# Altium schematic sheet sbc-base.SchDoc
size A3; DocumentNumber: 44; SheetNumber: 44; SheetTotal: 45; SheetDescription: System basic chip for MCU
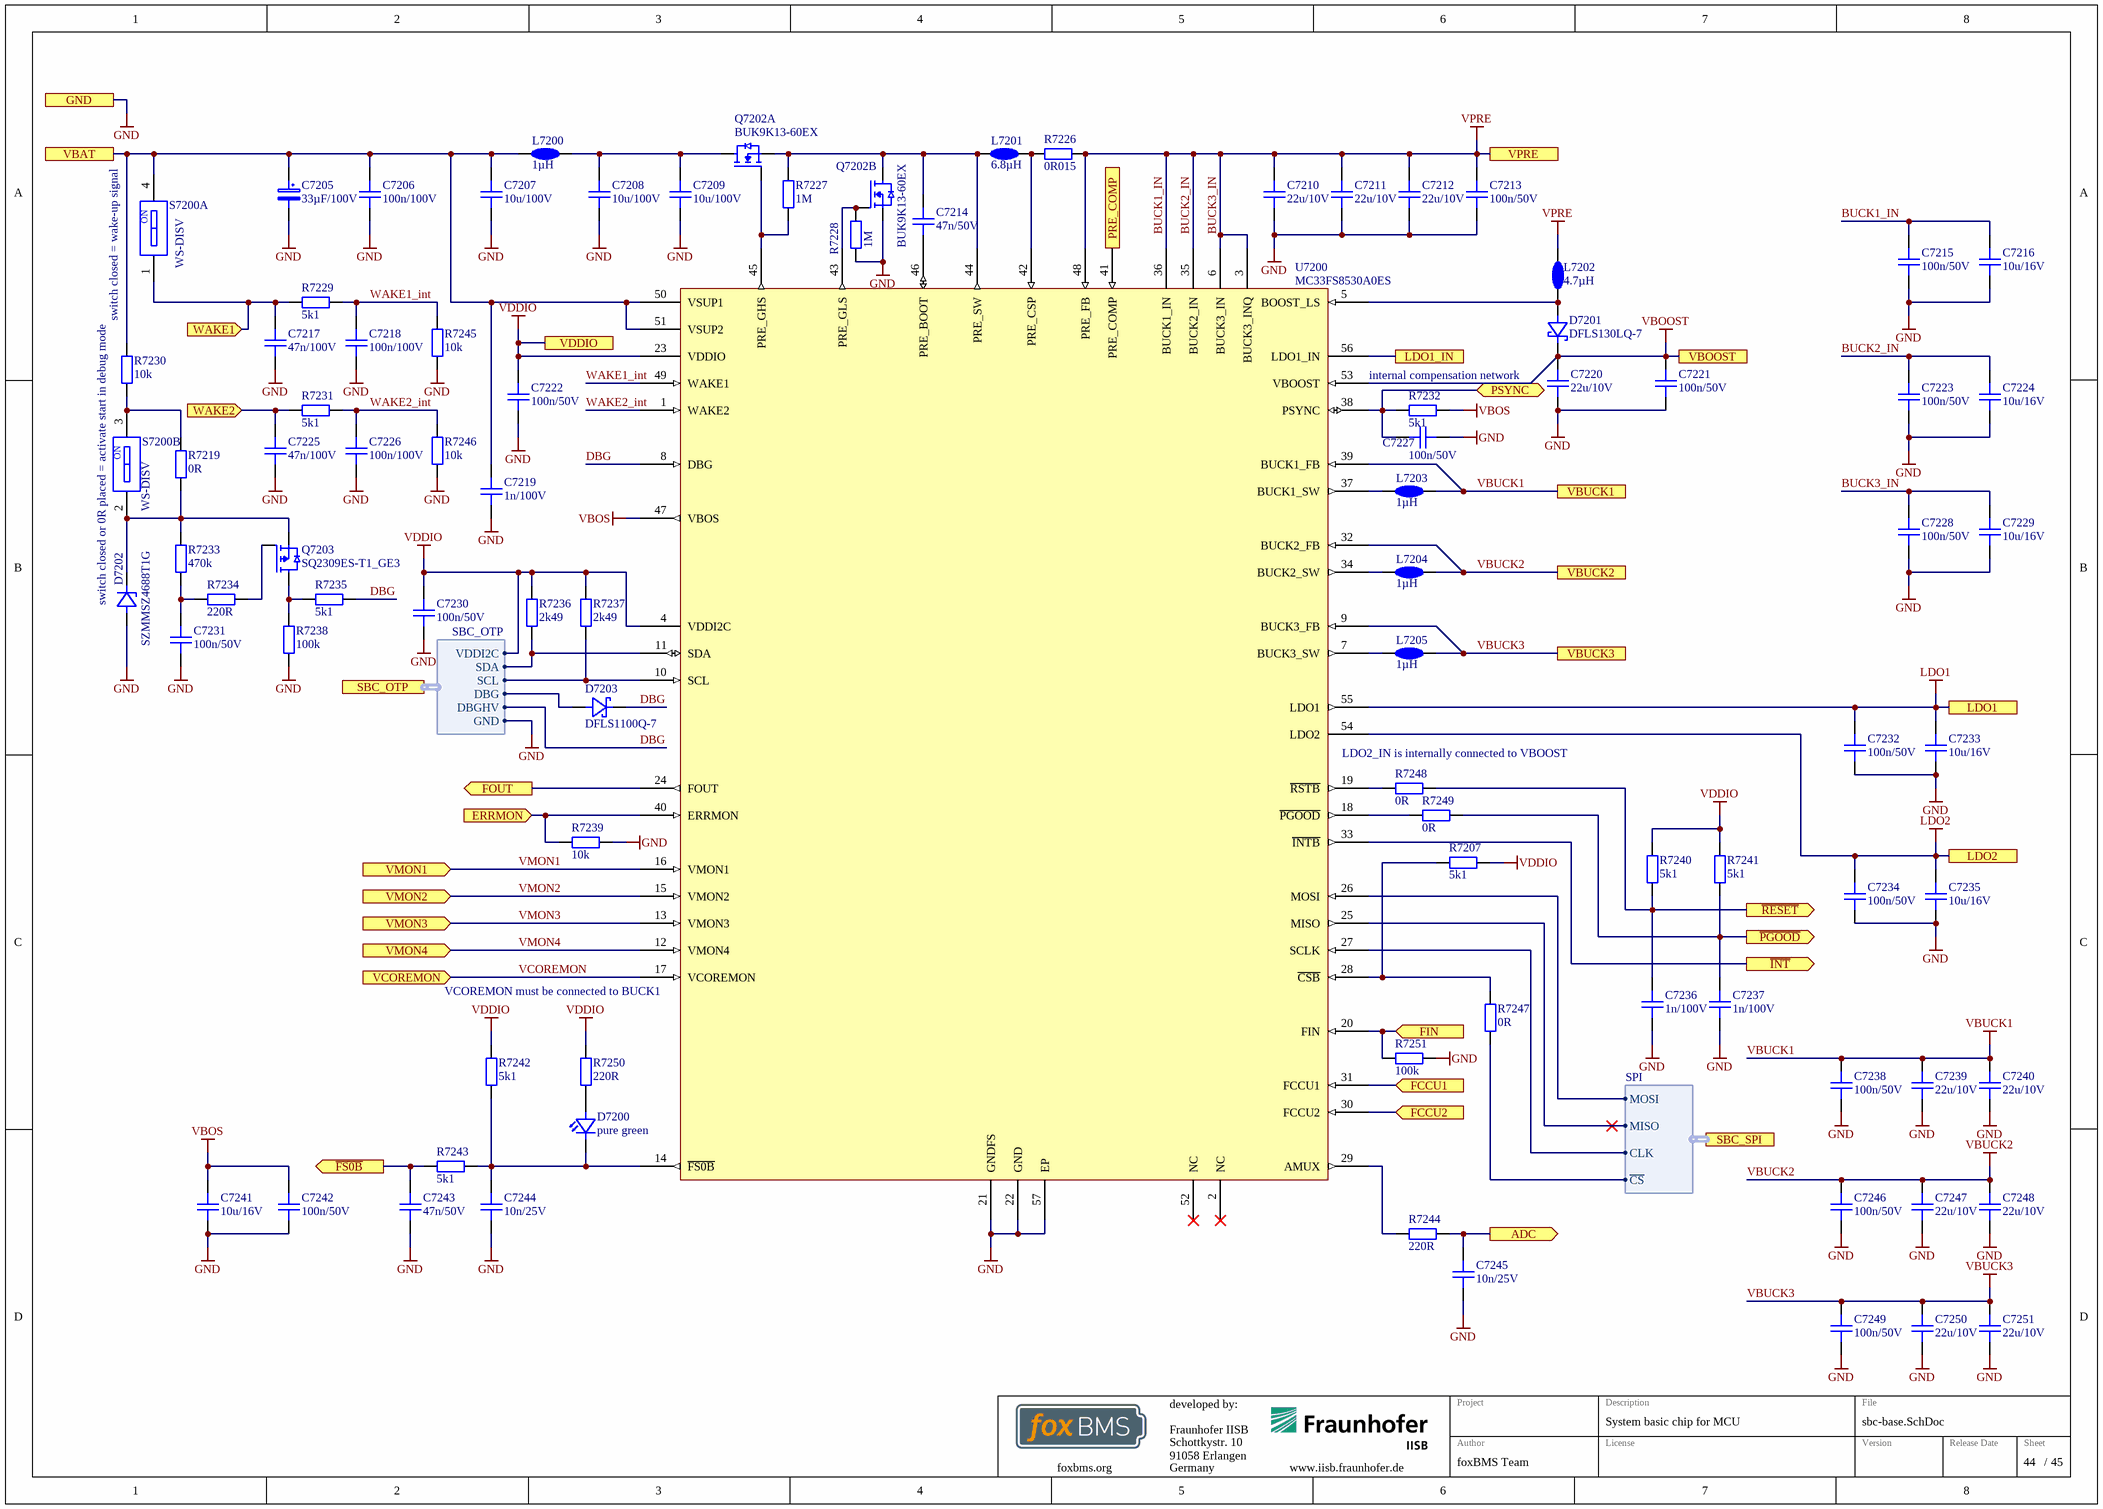
[diagram p0: sbc-base.SchDoc]

## Parts
C7205  33µF/100V  [ELECTROLYTIC_CAP_PANASONIC_G]
C7206  100n/100V  [CAPC1608X08N]
C7207  10u/100V  [CAPC5750X28N]
C7208  10u/100V  [CAPC5750X28N]
C7209  10u/100V  [CAPC5750X28N]
C7210  22u/10V  [CAPC3216X18N]
C7211  22u/10V  [CAPC3216X18N]
C7212  22u/10V  [CAPC3216X18N]
C7213  100n/50V  [CAPC1005X06N]
C7214  47n/50V  [CAPC1005X06N]
C7215  100n/50V  [CAPC1005X06N]
C7216  10u/16V  [CAPC2012X14N]
C7217  47n/100V  [CAPC1608X08N]
C7218  100n/100V  [CAPC1608X08N]
C7219  1n/100V  [CAPC1005X06N]
C7220  22u/10V  [CAPC3216X18N]
C7221  100n/50V  [CAPC1005X06N]
C7222  100n/50V  [CAPC1005X06N]
C7223  100n/50V  [CAPC1005X06N]
C7224  10u/16V  [CAPC2012X14N]
C7225  47n/100V  [CAPC1608X08N]
C7226  100n/100V  [CAPC1608X08N]
C7227  100n/50V  [CAPC1005X06N]
C7228  100n/50V  [CAPC1005X06N]
C7229  10u/16V  [CAPC2012X14N]
C7230  100n/50V  [CAPC1005X06N]
C7231  100n/50V  [CAPC1005X06N]
C7232  100n/50V  [CAPC1005X06N]
C7233  10u/16V  [CAPC2012X14N]
C7234  100n/50V  [CAPC1005X06N]
C7235  10u/16V  [CAPC2012X14N]
C7236  1n/100V  [CAPC1005X06N]
C7237  1n/100V  [CAPC1005X06N]
C7238  100n/50V  [CAPC1005X06N]
C7239  22u/10V  [CAPC3216X18N]
C7240  22u/10V  [CAPC3216X18N]
C7241  10u/16V  [CAPC2012X14N]
C7242  100n/50V  [CAPC1005X06N]
C7243  47n/50V  [CAPC1005X06N]
C7244  10n/25V  [CAPC1005X06N]
C7245  10n/25V  [CAPC1005X06N]
C7246  100n/50V  [CAPC1005X06N]
C7247  22u/10V  [CAPC3216X18N]
C7248  22u/10V  [CAPC3216X18N]
C7249  100n/50V  [CAPC1005X06N]
C7250  22u/10V  [CAPC3216X18N]
C7251  22u/10V  [CAPC3216X18N]
D7200  pure green  [LEDC1608X07N]
D7201  DFLS130LQ-7  [PowerDI123]
D7202  SZMMSZ4688T1G  [SOD-123_CASE-425-04-ISSUE-G]
D7203  DFLS1100Q-7  [PowerDI123]
L7200  1µH  [ASPIAIG-S4035]
L7201  6.8µH  [PA4342.XXXNLT_Footprint_2]
L7202  4.7µH  [ASPIAIG-S4035]
L7203  1µH  [TDK_TFM252012]
L7204  1µH  [TDK_TFM252012]
L7205  1µH  [TDK_TFM252012]
Q7202  BUK9K13-60EX  [NXP-SOT1205_N]  (parts A,B of 2)
Q7203  SQ2309ES-T1_GE3  [SOT95P237X110-3N]
R7207  5k1  [RESC1005X04N]
R7219  0R  [RESC1005X04N]
R7226  0R015  [PANASONIC_ERJ-B1]
R7227  1M  [RESC1005X04N]
R7228  1M  [RESC1005X04N]
R7229  5k1  [RESC1005X04N]
R7230  10k  [RESC1005X04N]
R7231  5k1  [RESC1005X04N]
R7232  5k1  [RESC1005X04N]
R7233  470k  [RESC1005X04N]
R7234  220R  [RESC1005X04N]
R7235  5k1  [RESC1005X04N]
R7236  2k49  [RESC1005X04N]
R7237  2k49  [RESC1005X04N]
R7238  100k  [RESC1005X04N]
R7239  10k  [RESC1005X04N]
R7240  5k1  [RESC1005X04N]
R7241  5k1  [RESC1005X04N]
R7242  5k1  [RESC1005X04N]
R7243  5k1  [RESC1005X04N]
R7244  220R  [RESC1005X04N]
R7245  10k  [RESC1005X04N]
R7246  10k  [RESC1005X04N]
R7247  0R  [RESC1005X04N]
R7248  0R  [RESC1005X04N]
R7249  0R  [RESC1005X04N]
R7250  220R  [RESC1005X04N]
R7251  100k  [RESC1005X04N]
S7200  WS-DISV  [WE_416131160802]  (parts A,B of 2)
U7200  MC33FS8530A0ES  [MC33FS8530A0ES]

## Ports
ADC (out), ERRMON (in), FCCU1 (in), FCCU2 (in), FIN (in), FOUT (out), GND, LDO1, LDO1_IN, LDO2, PRE_COMP (in), PSYNC (bidir), SBC_OTP (harness SBC_OTP), SBC_SPI (harness SPI), VBAT, VBOOST, VBUCK1, VBUCK2, VBUCK3, VCOREMON (in), VDDIO, VMON1 (in), VMON2 (in), VMON3 (in), VMON4 (in), VPRE, WAKE1 (in), WAKE2 (in), ~{FS0B} (out), ~{INT} (out), ~{PGOOD} (out), ~{RESET} (out)

## Harnesses
SBC_OTP: VDDI2C, SDA, SCL, GND, DBG, DBGHV
SPI: CLK, MOSI, MISO, ~{CS}

## Nets
BUCK1_IN: C7210.2 C7211.2 C7212.2 C7213.2 C7215.2 C7216.2 C7223.2 C7224.2 C7228.2 C7229.2 L7202.2 R7226.2 U7200.3(BUCK3_INQ) U7200.6(BUCK3_IN) U7200.35(BUCK2_IN) U7200.36(BUCK1_IN) U7200.48(PRE_FB) ; port VPRE  [also labelled BUCK2_IN, BUCK3_IN, VPRE]
GND: C7205.2 C7206.1 C7207.1 C7208.1 C7209.1 C7210.1 C7211.1 C7212.1 C7213.1 C7215.1 C7216.1 C7217.1 C7218.1 C7219.1 C7220.1 C7221.1 C7222.1 C7223.1 C7224.1 C7225.1 C7226.1 C7227.1 C7228.1 C7229.1 C7230.1 C7231.1 C7232.1 C7233.1 C7234.1 C7235.1 C7236.1 C7237.1 C7238.1 C7239.1 C7240.1 C7241.1 C7242.1 C7243.1 C7244.1 C7245.1 C7246.1 C7247.1 C7248.1 C7249.1 C7250.1 C7251.1 D7202.2(A) Q7202.3(S) R7228.1 R7238.1 R7239.1 R7245.2 R7246.2 R7251.2 U7200.21(GNDFS) U7200.22(GND) U7200.57(EP) ; port GND, port SBC_OTP.GND
LDO1: C7232.2 C7233.2 U7200.55(LDO1) ; port LDO1
LDO2: C7234.2 C7235.2 U7200.54(LDO2) ; port LDO2
VBOOST: C7220.2 C7221.2 D7201.1(K) U7200.53(VBOOST) ; port VBOOST
VBOS: C7241.2 C7242.2 R7232.2 U7200.47(VBOS)
VBUCK1: C7238.2 C7239.2 C7240.2 L7203.2 U7200.39(BUCK1_FB) ; port VBUCK1
VBUCK2: C7246.2 C7247.2 C7248.2 L7204.2 U7200.32(BUCK2_FB) ; port VBUCK2
VBUCK3: C7249.2 C7250.2 C7251.2 L7205.2 U7200.9(BUCK3_FB) ; port VBUCK3
VDDIO: C7222.2 C7230.2 R7207.1 R7236.2 R7237.2 R7240.2 R7241.2 R7242.2 R7250.2 U7200.4(VDDI2C) U7200.23(VDDIO) ; port VDDIO, port SBC_OTP.VDDI2C
~{FS0B}: C7243.2 R7243.2 ; port ~{FS0B}
~{INT}: U7200.33(~{INTB}) ; port ~{INT}
~{PGOOD}: C7237.2 R7241.1 R7249.2 ; port ~{PGOOD}
~{RESET}: C7236.2 R7240.1 R7248.1 ; port ~{RESET}
ADC: C7245.2 R7244.2 ; port ADC
DBG: D7203.1(K) R7235.1 U7200.8(DBG) ; port SBC_OTP.DBGHV
ERRMON: R7239.2 U7200.40(ERRMON) ; port ERRMON
FCCU1: U7200.31(FCCU1) ; port FCCU1
FCCU2: U7200.30(FCCU2) ; port FCCU2
FIN: R7251.1 U7200.20(FIN) ; port FIN
FOUT: U7200.24(FOUT) ; port FOUT
LDO1_IN: U7200.56(LDO1_IN) ; port LDO1_IN
PRE_COMP: U7200.41(PRE_COMP) ; port PRE_COMP
PSYNC: C7227.2 R7232.1 U7200.38(PSYNC) ; port PSYNC
VBAT: C7205.1 C7206.2 C7207.2 C7219.2 L7200.1 R7230.2 S7200.4 U7200.50(VSUP1) U7200.51(VSUP2) ; port VBAT
VCOREMON: U7200.17(VCOREMON) ; port VCOREMON
VMON1: U7200.16(VMON1) ; port VMON1
VMON2: U7200.15(VMON2) ; port VMON2
VMON3: U7200.13(VMON3) ; port VMON3
VMON4: U7200.12(VMON4) ; port VMON4
WAKE1: C7217.2 R7229.2 S7200.1 ; port WAKE1
WAKE1_int: C7218.2 R7229.1 R7245.1 U7200.49(WAKE1)
WAKE2: C7225.2 R7231.2 ; port WAKE2
WAKE2_int: C7226.2 R7231.1 R7246.1 U7200.1(WAKE2)
NetC7208_2: C7208.2 C7209.2 L7200.2 Q7202.7(D)
NetC7214_1: C7214.1 U7200.46(PRE_BOOT)
NetC7214_2: C7214.2 L7201.1 Q7202.1(S) Q7202.5(D) R7227.2 U7200.44(PRE_SW)
NetC7231_2: C7231.2 R7233.1 R7234.1
NetC7244_2: C7244.2 D7200.1(C) R7242.1 R7243.1 U7200.14(~{FS0B})
NetD7200_2: D7200.2(A) R7250.1
NetD7201_2: D7201.2(A) L7202.1 U7200.5(BOOST_LS)
NetD7202_1: D7202.1(K) Q7203.S R7219.1 R7233.2 S7200.2
NetD7203_2: D7203.2(A) ; port SBC_OTP.DBG
NetL7201_2: L7201.2 R7226.1 U7200.42(PRE_CSP)
NetL7203_1: L7203.1 U7200.37(BUCK1_SW)
NetL7204_1: L7204.1 U7200.34(BUCK2_SW)
NetL7205_1: L7205.1 U7200.7(BUCK3_SW)
NetQ7202_2: Q7202.2(G) R7227.1 U7200.45(PRE_GHS)
NetQ7202_4: Q7202.4(G) R7228.2 U7200.43(PRE_GLS)
NetQ7203_D: Q7203.D R7235.2 R7238.2
NetQ7203_G: Q7203.G R7234.2
NetR7207_2: R7207.2 R7247.2 U7200.28(~{CSB})
NetR7219_2: R7219.2 R7230.1 S7200.3
NetR7236_1: R7236.1 U7200.11(SDA) ; port SBC_OTP.SDA
NetR7237_1: R7237.1 U7200.10(SCL) ; port SBC_OTP.SCL
NetR7244_1: R7244.1 U7200.29(AMUX)
NetR7247_1: R7247.1 ; port SBC_SPI.~{CS}
NetR7248_2: R7248.2 U7200.19(~{RSTB})
NetR7249_1: R7249.1 U7200.18(~{PGOOD})
NetU7200_25: U7200.25(MISO) ; port SBC_SPI.MISO
NetU7200_26: U7200.26(MOSI) ; port SBC_SPI.MOSI
NetU7200_27: U7200.27(SCLK) ; port SBC_SPI.CLK

Not connected (* = marked no-connect by the designer): U7200 2(NC)* 52(NC)*

## Notes on the sheet
- (near R7230) switch closed = wake-up signal
- (near C7220) internal compensation network
- switch closed or 0R placed = activate start in debug mode
- (near U7200) LDO2_IN is internally connected to VBOOST
- (near U7200) VCOREMON must be connected to BUCK1
- Fraunhofer IISB
- Schottkystr. 10
- developed by:
- 91058 Erlangen
- Germany
- Author
- Project
- License
- Description
- File
- Version
- Release Date
- Sheet
- foxbms.org <https://foxbms.org>
- www.iisb.fraunhofer.de <https://www.iisb.fraunhofer.de/>
- foxBMS Team
- /
- (in symbol WE_416131160802, part A) ON
- (in symbol WE_416131160802, part B) ON

## Library data of the parts
C7205 = EEE-TG2A330P: SMD Electrolytic Capacitor; Capacitance: 33µF; Rated Voltage: 100V; Tolerance: +-20%; Heigth: 10.5mm; Automotive Qualified: True; Part Number: EEE-TG2A330P; Operating Temperature: -40°C to 125°C; Diameter: 10mm; ComponentLink1Description: Datasheet; ComponentLink1URL: https://industrial.panasonic.com/cdbs/www-data/pdf/RDE0000/ABA0000C1187.pdf; Supplier 1: Digikey; Supplier Part Number 1: PCE4126CT-ND
C7206 C7218 C7226 = gen_C_ceramic_100n_100V_X7R_0603: MLCC; Capacitance: 100n; Rated Voltage: 100V; Dielectric: X7R; Case EIA: 0603; Case Metric: 1608; Automotive Qualified: True; PnP Package: 0603C; Part Number: gen_C_ceramic_100n_100V_X7R_0603; Supplier 1: Digikey; Supplier Part Number 1: 490-13420-1-ND; Supplier 2: Mouser; Supplier Part Number 2: 81-GCJ188R72A104KA1D
C7207-C7209 = gen_C_ceramic_10u_100V_X7S_2220: MLCC; Capacitance: 10u; Rated Voltage: 100V; Dielectric: X7S; Case EIA: 2220; Case Metric: 5750; Automotive Qualified: True; AEC-Q Grade: Grade 0; AEC-Q Norm: AEC-Q200; Part Number: gen_C_ceramic_10u_100V_X7S_2220; Supplier 1: Digikey; Supplier Part Number 1: 445-13152-1-ND; ECCN: EAR99
C7210-C7212 C7220 C7239 C7240 C7247 C7248 C7250 C7251 = gen_C_ceramic_22u_10V_X7R_1206: MLCC; Capacitance: 22u; Rated Voltage: 10V; Dielectric: X7R; Case EIA: 1206; Case Metric: 3216; Automotive Qualified: True; Part Number: gen_C_ceramic_22u_10V_X7R_1206; Supplier 1: Digikey; Supplier Part Number 1: 587-4243-1-ND
C7213 C7215 C7221-C7223 C7227 C7228 C7230-C7232 C7234 C7238 C7242 C7246 C7249 = gen_C_ceramic_100n_50V_X7R_0402: MLCC; Capacitance: 100n; Rated Voltage: 50V; Dielectric: X7R; Case EIA: 0402; Case Metric: 1005; PnP Package: 0402C; PnP Value: 100nF/50V/X7R; PnP equipped: x; Automotive Qualified: True; AEC-Q Norm: AEC-Q200; Part Number: gen_C_ceramic_100n_50V_X7R_0402; Supplier 1: Farnell; Supplier Part Number 1: 2210822; ECCN: EAR99
C7214 C7243 = gen_C_ceramic_47n_50V_X7R_0402: MLCC; Capacitance: 47n; Rated Voltage: 50V; Dielectric: X7R; Case EIA: 0402; Case Metric: 1005; Automotive Qualified: True; PnP Package: 0402C; Part Number: gen_C_ceramic_47n_50V_X7R_0402; Supplier 1: Farnell; Supplier Part Number 1: 2210827
C7216 C7224 C7229 C7233 C7235 C7241 = gen_C_ceramic_10u_16V_X7R_0805: MLCC; Capacitance: 10u; Rated Voltage: 16V; Dielectric: X7S; Case EIA: 0805; Case Metric: 2012; Automotive Qualified: True; AEC-Q Grade: Grade 1; AEC-Q Norm: AEC-Q200; Part Number: gen_C_ceramic_10u_16V_X7R_0805; ECCN: EAR99; Supplier 1: Digikey; Supplier Part Number 1: 445-16110-1-ND
C7217 C7225 = gen_C_ceramic_47n_100V_X7R_0603: MLCC; Capacitance: 47n; Rated Voltage: 100V; Dielectric: X7R; Case EIA: 0603; Case Metric: 1608; Automotive Qualified: True; PnP Package: 0603C; Part Number: gen_C_ceramic_47n_100V_X7R_0603; Supplier 1: Farnell; Supplier Part Number 1: 2478249; Supplier 2: Farnell; Supplier Part Number 2: 2708699; Supplier 3: Farnell; Supplier Part Number 3: 2905110
C7219 C7236 C7237 = gen_C_ceramic_1n_100V_X7R_0402: MLCC; Capacitance: 1n; Rated Voltage: 100V; Dielectric: X7R; Case EIA: 0402; Case Metric: 1005; Automotive Qualified: True; PnP Package: 0402C; Part Number: gen_C_ceramic_1n_100V_X7R_0402; Supplier 1: Digikey; Supplier Part Number 1: 490-4764-1-ND
C7244 C7245 = gen_C_ceramic_10n_25V_X7R_0402: MLCC; Capacitance: 10n; Rated Voltage: 25V; Dielectric: X7R; Case EIA: 0402; Case Metric: 1005; PnP Package: 0402C; PnP Value: 10nF/25V/X7R; PnP equipped: x; Automotive Qualified: True; Part Number: gen_C_ceramic_10n_25V_X7R_0402; Supplier 1: Farnell; Supplier Part Number 1: 2210793
D7200 = LED_0603_pure_green_AECQ: TLMP1100-GS08; Manufacturer: Vishay; Breakdown Voltage: 5V; Continuous Forward Current: 20mA; Forward Voltage @ 20mA: 2.1V; Automotive Qualified: True; Part Number: LED_0603_pure_green_AECQ; Color: pure green; Operating Temperature: -40°C - 100°C; ComponentLink1Description: Datasheet; ComponentLink1URL: http://www.farnell.com/datasheets/2049164.pdf; Supplier 1: Farnell; Supplier Part Number 1: 1328306; Supplier 2: Digikey; Supplier Part Number 2: 751-1176-1-ND; PnP Package: LED_0603
D7201 = DFLS130LQ-7: Schottky Diode; Manufacturer: Diodes Inc.; Breakdown Voltage: 30V; Continuous Forward Current: 1A; Automotive Qualified: True; Part Number: DFLS130LQ-7; Part Name: DFLS130LQ-7; Operating Temperature: −40°C - +125°C; ComponentLink1Description: Datasheet; ComponentLink1URL: https://www.diodes.com/assets/Datasheets/DFLS130LQ.pdf; Supplier 1: Digikey; Supplier Part Number 1: DFLS130LQ-7DICT-ND
D7202 = SZMMSZ4688T1G: Zener Diode; Manufacturer: ON Semiconductor; Breakdown Voltage: 4.7V; PnP Package: SOD123; Automotive Qualified: True; Part Number: SZMMSZ4688T1G; Part Name: SZMMSZ4688T1G; Operating Temperature: -55°C - +150°C; ComponentLink1Description: Datasheet; ComponentLink1URL: https://www.onsemi.com/pub/Collateral/MMSZ4678T1-D.PDF; Supplier 1: Digikey; Supplier Part Number 1: SZMMSZ4688T1GOSCT-ND; Supplier 2: Farnell; Supplier Part Number 2: 2774579; Supplier 3: Mouser; Supplier Part Number 3: 863-SZMMSZ4688T1G
D7203 = DFLS1100Q-7: Schottky Diode; Manufacturer: Diodes Inc.; Breakdown Voltage: 100V; Continuous Forward Current: 1A; Automotive Qualified: True; Part Number: DFLS1100Q-7; Part Name: DFLS1100Q-7; Operating Temperature: −55°C - +175°C; ComponentLink1Description: Datasheet; ComponentLink1URL: https://www.diodes.com/assets/Datasheets/ds30497.pdf; Supplier 1: Mouser; Supplier Part Number 1: 621-DFLS1-100Q-7; Supplier 2: Digikey; Supplier Part Number 2: DFLS1100Q-7DICT-ND; Supplier 3: Farnell; Supplier Part Number 3: 3127293; PnP Package: POWERDI123
L7200 = ASPIAIG-S4035-1R0M-T: Power Inductor; Manufacturer: Abracon LLC; Rated Current: 4.5A; Saturation Current: 6.9A; Automotive Qualified: True; Part Number: ASPIAIG-S4035-1R0M-T; Operating Temperature: –40°C - +125°C; ComponentLink1Description: Datasheet; ComponentLink1URL: https://abracon.com/Magnetics/power/ASPIAIG-S4035.pdf; Inductance: 1µH; Supplier 1: Digikey; Supplier Part Number 1: 535-14223-1-ND; Supplier 2: Farnell; Supplier Part Number 2: 2848347
L7201 = PA4342.682NLT: Power Inductor; Manufacturer: Pulse; Rated Current: 8.5A; Saturation Current: 13.5A; Automotive Qualified: True; Part Number: PA4342.682NLT; Operating Temperature: -40°C - +125°C; ComponentLink1Description: Datasheet; ComponentLink1URL: https://www.mouser.de/datasheet/2/336/P769-1526786.pdf; Inductance: 6.8µH; Supplier 1: Digikey; Supplier Part Number 1: 553-3442-1-ND; Supplier 2: Mouser; Supplier Part Number 2: 673-PA4342.682NLT
L7202 = ASPIAIG-S4035-4R7M-T: Power Inductor; Manufacturer: Abracon LLC; Rated Current: 2.45A; Saturation Current: 3.2A; Automotive Qualified: True; Part Number: ASPIAIG-S4035-4R7M-T; Operating Temperature: –40°C - +125°C; ComponentLink1Description: Datasheet; ComponentLink1URL: https://abracon.com/Magnetics/power/ASPIAIG-S4035.pdf; Inductance: 4.7µH; Supplier 1: Digikey; Supplier Part Number 1: 535-14227-1-ND
L7203-L7205 = TFM252012ALMA1R0MTAA: Power Inductor; Manufacturer: TDK; Rated Current: 3.7A; Saturation Current: 4.2A; Automotive Qualified: True; Part Number: TFM252012ALMA1R0MTAA; Operating Temperature: –55°C - +150°C; ComponentLink1Description: Datasheet; ComponentLink1URL: https://product.tdk.com/info/en/catalog/datasheets/inductor_automotive_power_tfm252012alma_en.pdf; Inductance: 1µH; Supplier 1: Digikey; Supplier Part Number 1: 445-175183-1-ND
Q7202 = BUK9K13-60EX: Dual N-channel 60 V, 12.5 mΩ logic level MOSFET; Manufacturer: Nexperia; Maximum Drain-Source Voltage: 60V; Maximum Continous Drain Current (25°C): 40A; R_DS(on): 12.5m; Total Gate Charge: 7.9nC; Automotive Qualified: True; AEC-Q Norm: AEC-Q101; AEC-Q Grade: Grade 0; Part Number: BUK9K13-60EX; Part Name: BUK9K13-60EX; Operating Temperature: -55°C - +170°C; ComponentLink1Description: Datasheet; ComponentLink1URL: https://4donline.ihs.com/images/VipMasterIC/IC/NEXP/NEXP-S-A0003105620/NEXP-S-A0003105797-1.pdf?hkey=6D3A4C79FDBF58556ACFDE234799DDF0; Supplier 1: Digikey; Supplier Part Number 1: 1727-2467-1-ND; Supplier 2: Mouser; Supplier Part Number 2: 771-BUK9K13-60EX; Supplier 3: Farnell; Supplier Part Number 3: 3439704; ECCN: EAR99
Q7203 = SQ2309ES-T1_GE3: MOSFET-Transistor, p-channel, -1.7 A, -60 V; Manufacturer: Vishay; Maximum Drain-Source Voltage: 60V; Maximum Continous Drain Current (25°C): 1.7A; R_DS(on): 336m; Total Gate Charge: 8.5nC; Automotive Qualified: True; Part Number: SQ2309ES-T1_GE3; Part Name: PMOS; Operating Temperature: -55°C - +175°C; ComponentLink1Description: Datasheet; ComponentLink1URL: http://www.vishay.com/docs/67024/sq2309es.pdf; Supplier 1: Digikey; Supplier Part Number 1: SQ2309ES-T1_GE3CT-ND; Supplier 2: Farnell; Supplier Part Number 2: 2617108; Supplier 3: Mouser; Supplier Part Number 3: 781-SQ2309ES-T1_GE3
R7207 R7229 R7231 R7232 R7235 R7240-R7243 = gen_R_5k1_0402: SMD Resistor 5k1 0402; Tolerance: 1%; Power: 0.063W; Case EIA: 0402; Case Metric: 1005; Maximum Working Voltage: 50V; PnP Package: 0402R; PnP equipped: x; Automotive Qualified: True; AEC-Q Grade: Grade 0; AEC-Q Norm: AEC-Q200; Part Number: gen_R_5k1_0402; Operating Temperature: -55°C - +155°C; Resistance: 5k1; Series: E24; PnP Value: 5k1; ECCN: EAR99; Supplier 1: Farnell; Supplier Part Number 1: 2302709
R7219 R7247-R7249 = gen_R_0R_0402: SMD Resistor 0R 0402; Power: 0.063W; Case EIA: 0402; Case Metric: 1005; Maximum Working Voltage: 50V; PnP Package: 0402R; Automotive Qualified: True; AEC-Q Norm: AEC-Q200; PnP equipped: x; Part Number: gen_R_0R_0402; Operating Temperature: -55°C - +155°C; Resistance: 0R; Series: Jumper; PnP Value: 0R; Supplier 1: Farnell; Supplier Part Number 1: 1469661; Supplier 2: Farnell; Supplier Part Number 2: 2059190; ECCN: EAR99
R7226 = ERJ-B1CFR015U: SMD Shunt Resistor 0R015; Tolerance: 1%; Power: 2W; Case EIA: ERJ-B1; Maximum Working Voltage: 200V; Automotive Qualified: True; Part Number: ERJ-B1CFR015U; Operating Temperature: -55°C - +155°C; Resistance: 0R015; Supplier 1: Farnell; Supplier Part Number 1: 2294050; Supplier 2: Mouser; Supplier Part Number 2: 667-ERJ-B1CFR015U
R7227 R7228 = gen_R_1M_0402: SMD Resistor 1M 0402; Tolerance: 1%; Power: 0.063W; Case EIA: 0402; Case Metric: 1005; Maximum Working Voltage: 50V; PnP Package: 0402R; Automotive Qualified: True; AEC-Q Grade: Grade 0; AEC-Q Norm: AEC-Q200; Part Number: gen_R_1M_0402; Operating Temperature: -55°C - +155°C; Resistance: 1M; Series: E24, E96; PnP Value: 1M; ECCN: EAR99; Supplier 1: Digikey; Supplier Part Number 1: A129663CT-ND
R7230 R7245 R7246 = gen_R_10k_0402: SMD Resistor 10k 0402; Tolerance: 1%; Power: 0.063W; Case EIA: 0402; Case Metric: 1005; Maximum Working Voltage: 50V; PnP Package: 0402R; PnP equipped: x; Automotive Qualified: True; AEC-Q Norm: AEC-Q200; Part Number: gen_R_10k_0402; Operating Temperature: -55°C - +155°C; Resistance: 10k; Series: E24, E96; PnP Value: 10k; Supplier 1: Farnell; Supplier Part Number 1: 2059239; ECCN: EAR99
R7233 = gen_R_470k_0402: SMD Resistor 470k 0402; Tolerance: 1%; Power: 0.063W; Case EIA: 0402; Case Metric: 1005; Maximum Working Voltage: 50V; PnP Package: 0402R; Automotive Qualified: True; Part Number: gen_R_470k_0402; Operating Temperature: -55°C - +155°C; Resistance: 470k; Series: E24; PnP Value: 470k; Supplier 1: Farnell; Supplier Part Number 1: 2302916
R7234 R7244 = gen_R_220R_0402: SMD Resistor 220R 0402; Tolerance: 1%; Power: 0.063W; Case EIA: 0402; Case Metric: 1005; Maximum Working Voltage: 50V; PnP Package: 0402R; Automotive Qualified: True; AEC-Q Grade: Grade 0; AEC-Q Norm: AEC-Q200; Part Number: gen_R_220R_0402; Operating Temperature: -55°C - +155°C; Resistance: 220R; Series: E24; PnP Value: 220R; ECCN: EAR99; Supplier 1: Digikey; Supplier Part Number 1: A129619CT-ND
R7236 R7237 = gen_R_2k49_0402: SMD Resistor 2k49 0402; Tolerance: 1%; Power: 0.063W; Case EIA: 0402; Case Metric: 1005; Maximum Working Voltage: 50V; PnP Package: 0402R; Automotive Qualified: True; Part Number: gen_R_2k49_0402; Operating Temperature: -55°C - +155°C; Resistance: 2k49; Series: E96; PnP Value: 2k49; Supplier 1: Farnell; Supplier Part Number 1: 2059135
R7238 R7251 = gen_R_100k_0402: SMD Resistor 100k 0402; Tolerance: 1%; Power: 0.063W; Case EIA: 0402; Case Metric: 1005; Maximum Working Voltage: 50V; PnP Package: 0402R; PnP equipped: x; Automotive Qualified: True; Part Number: gen_R_100k_0402; Operating Temperature: -55°C - +155°C; Resistance: 100k; Series: E24, E96; PnP Value: 100k; Supplier 1: Farnell; Supplier Part Number 1: 2302839
R7239 = gen_R_10k_0402: SMD Resistor 10k 0402; Tolerance: 1%; Power: 0.063W; Case EIA: 0402; Case Metric: 1005; Maximum Working Voltage: 50V; PnP Package: 0402R; Automotive Qualified: True; PnP equipped: x; AEC-Q Norm: AEC-Q200; Part Number: gen_R_10k_0402; Operating Temperature: -55°C - +155°C; Resistance: 10k; Series: E24, E96; PnP Value: 10k; Supplier 1: Farnell; Supplier Part Number 1: 2059239; ECCN: EAR99
R7250 = gen_R_220R_0402: SMD Resistor 220R 0402; Tolerance: 1%; Power: 0.063W; Case EIA: 0402; Case Metric: 1005; Maximum Working Voltage: 50V; PnP Package: 0402R; Automotive Qualified: True; AEC-Q Norm: AEC-Q200; AEC-Q Grade: Grade 0; Part Number: gen_R_220R_0402; Operating Temperature: -55°C - +155°C; Resistance: 220R; Series: E24; PnP Value: 220R; Supplier 1: Digikey; Supplier Part Number 1: A129619CT-ND; ECCN: EAR99
S7200 = WE_416131160802: WS-DISV Small Compact SMT DipSwitch; Manufacturer: Würth Elektronik; Automotive Qualified: False; Part Number: WE_416131160802; Part Name: WS-DISV; Operating Temperature: -40°C - +85°C; ComponentLink1Description: Datasheet; ComponentLink1URL: https://www.we-online.de/katalog/datasheet/418121270802.pdf; Supplier 1: Digikey; Supplier Part Number 1: 732-3852-1-ND; Supplier 2: Mouser; Supplier Part Number 2: 710-416131160802
U7200 = MC33FS8530A0ES: Fail-safe system basis chip with multiple SMPS and LDO; Manufacturer: NXP; PnP Package: HPQFN-56; Automotive Qualified: True; AEC-Q Norm: AEC-Q100; AEC-Q Grade: Grade 1; Part Number: MC33FS8530A0ES; Part Name: MC33FS8530A0ES; Operating Temperature: −40°C - +125°C; Supplier 1: Mouser; Supplier Part Number 1: 771-MC33FS8530A0ES; Supplier 2: Digikey; Supplier Part Number 2: 568-MC33FS8530A0ES-ND; ECCN: EAR99